# Altium schematic sheet tm.SchDoc
size A4
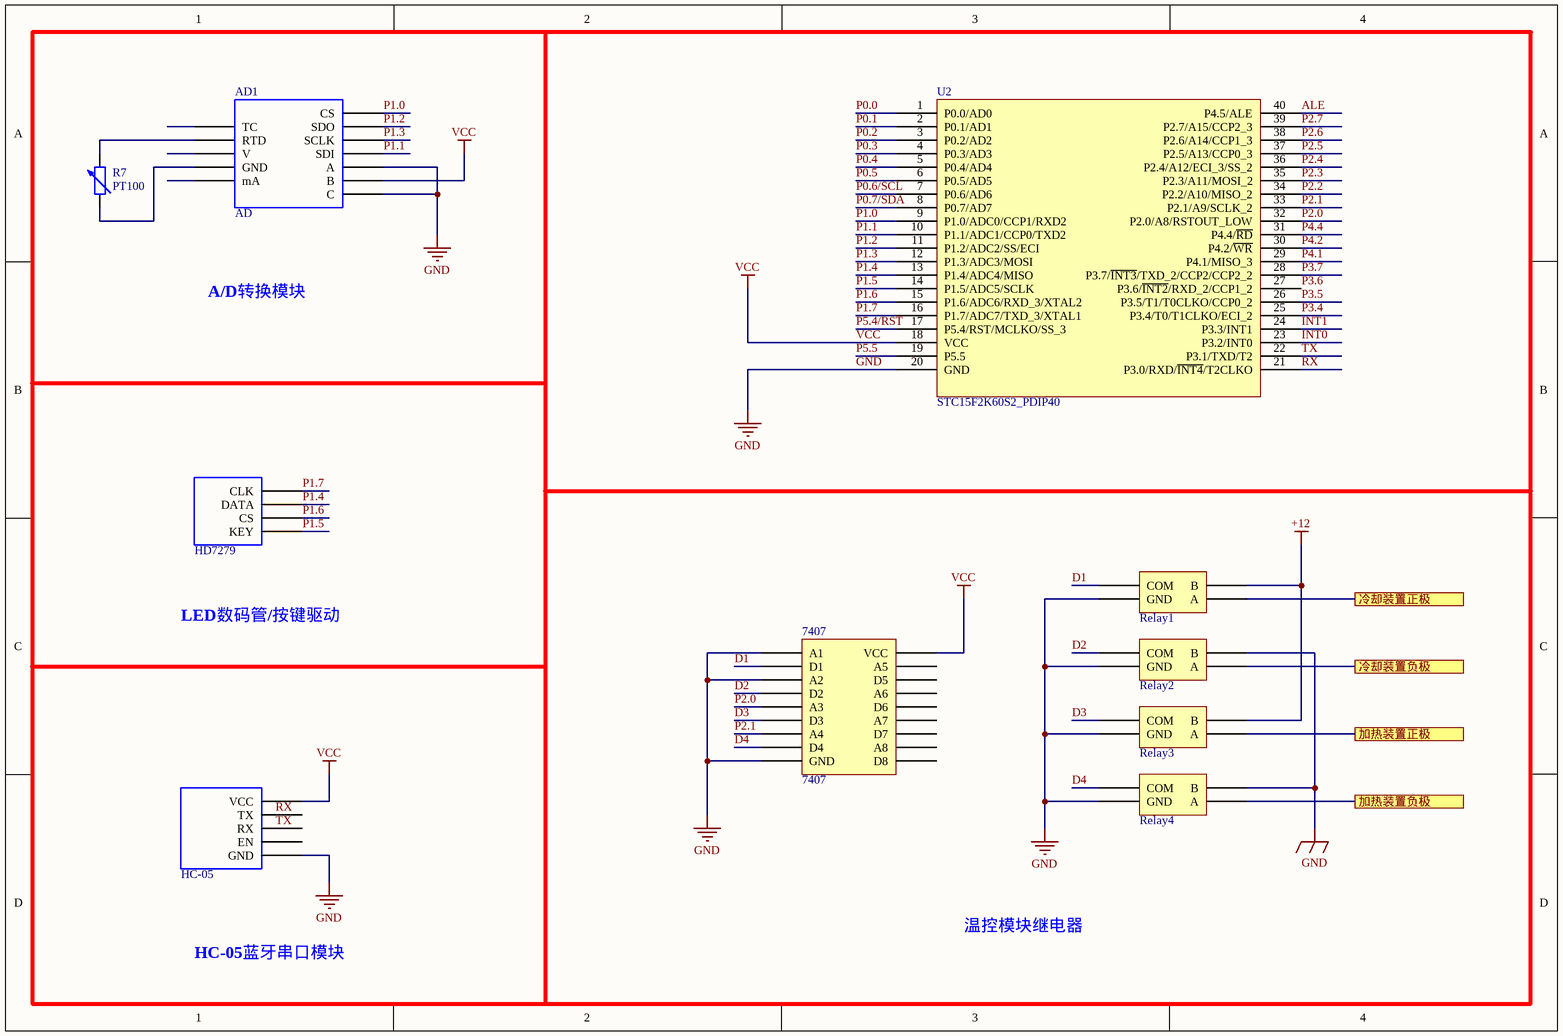
[diagram p0: tm.SchDoc]

## Parts
2  HC-05
7407  7407
*1  HD7279
AD1  AD
R7  PT100  [AXIAL-0.6]
Relay1  Relay  (value not drawn)
Relay2  Relay  (value not drawn)
Relay3  Relay  (value not drawn)
Relay4  Relay  (value not drawn)
U2  STC15F2K60S2_PDIP40  [DIP40]

## Ports
冷却装置正极, 冷却装置负极, 加热装置正极, 加热装置负极

## Nets
+12: Relay1.87(B) Relay3.87(B)
GND: 2.37(GND) 7407.62(A1) 7407.64(A2) 7407.70(GND) AD1.48(A) AD1.50(C) Relay1.85(GND) Relay2.85(GND) Relay2.87(B) Relay3.85(GND) Relay4.85(GND) Relay4.87(B) U2.20(GND)
VCC: 2.33(VCC) 7407.56(VCC) AD1.49(B) U2.18(VCC)
ALE: U2.40(P4.5/ALE)
D1: 7407.63(D1) Relay1.84(COM)
D2: 7407.65(D2) Relay2.84(COM)
D3: 7407.67(D3) Relay3.84(COM)
D4: 7407.69(D4) Relay4.84(COM)
INT0: U2.23(P3.2/INT0)
INT1: U2.24(P3.3/INT1)
P0.0: U2.1(P0.0/AD0)
P0.1: U2.2(P0.1/AD1)
P0.2: U2.3(P0.2/AD2)
P0.3: U2.4(P0.3/AD3)
P0.4: U2.5(P0.4/AD4)
P0.5: U2.6(P0.5/AD5)
P0.6/SCL: U2.7(P0.6/AD6)
P0.7/SDA: U2.8(P0.7/AD7)
P1.0: AD1.44(CS) U2.9(P1.0/ADC0/CCP1/RXD2)
P1.1: AD1.47(SDI) U2.10(P1.1/ADC1/CCP0/TXD2)
P1.2: AD1.45(SDO) U2.11(P1.2/ADC2/SS/ECI)
P1.3: AD1.46(SCLK) U2.12(P1.3/ADC3/MOSI)
P1.4: *1.30(DATA) U2.13(P1.4/ADC4/MISO)
P1.5: *1.32(KEY) U2.14(P1.5/ADC5/SCLK)
P1.6: *1.31(CS) U2.15(P1.6/ADC6/RXD_3/XTAL2)
P1.7: *1.29(CLK) U2.16(P1.7/ADC7/TXD_3/XTAL1)
P2.0: 7407.66(A3) U2.32(P2.0/A8/RSTOUT_LOW)
P2.1: 7407.68(A4) U2.33(P2.1/A9/SCLK_2)
P2.2: U2.34(P2.2/A10/MISO_2)
P2.3: U2.35(P2.3/A11/MOSI_2)
P2.4: U2.36(P2.4/A12/ECI_3/SS_2)
P2.5: U2.37(P2.5/A13/CCP0_3)
P2.6: U2.38(P2.6/A14/CCP1_3)
P2.7: U2.39(P2.7/A15/CCP2_3)
P3.4: U2.25(P3.4/T0/T1CLKO/ECI_2)
P3.5: U2.26(P3.5/T1/T0CLKO/CCP0_2)
P3.6: U2.27(P3.6/~{INT2}/RXD_2/CCP1_2)
P3.7: U2.28(P3.7/~{INT3}/TXD_2/CCP2/CCP2_2)
P4.1: U2.29(P4.1/MISO_3)
P4.2: U2.30(P4.2/~{WR})
P4.4: U2.31(P4.4/~{RD})
P5.4/RST: U2.17(P5.4/RST/MCLKO/SS_3)
P5.5: U2.19(P5.5)
RX: U2.21(P3.0/RXD/~{INT4}/T2CLKO)
TX: U2.22(P3.1/TXD/T2)
冷却装置正极: Relay1.86(A) ; port 冷却装置正极
冷却装置负极: Relay2.86(A) ; port 冷却装置负极
加热装置正极: Relay3.86(A) ; port 加热装置正极
加热装置负极: Relay4.86(A) ; port 加热装置负极
NetAD1_51: AD1.51(GND) R7.1
NetAD1_53: AD1.53(RTD) R7.2

Not connected (* = marked no-connect by the designer): 2 34(TX) 35(RX) 36(EN); 7407 57(A5) 58(D5) 59(A6) 60(D6) 61(A7) 71(D7) 72(A8) 73(D8); AD1 52(TC) 54(V) 55(mA)

## Notes on the sheet
- A/D转换模块
- LED数码管/按键驱动
- HC-05蓝牙串口模块
- 温控模块继电器
- Labels drawn without touching a wire or pin: RX, TX

## Library data of the parts
*1 = HD7279_
AD1 = AD_Module
R7 = Res Adj2: Variable Resistor; Value: 1K; Set Position: 0.5; Published: 8-Jun-2000; LatestRevisionDate: 17-Jul-2002; LatestRevisionNote: Re-released for DXP Platform.; PackageReference: AXIAL-0.6; Publisher: Altium Limited; PackageDescription: Axial Device, Thru-Hole; 2 Leads; 0.6 in Pin Spacing